# EAGLE design BQ27541 (EAGLE 9.3.0)
CNAME: Fuel Gauge Board; CREVISION: 1A; DESIGNER: µgurkrcl
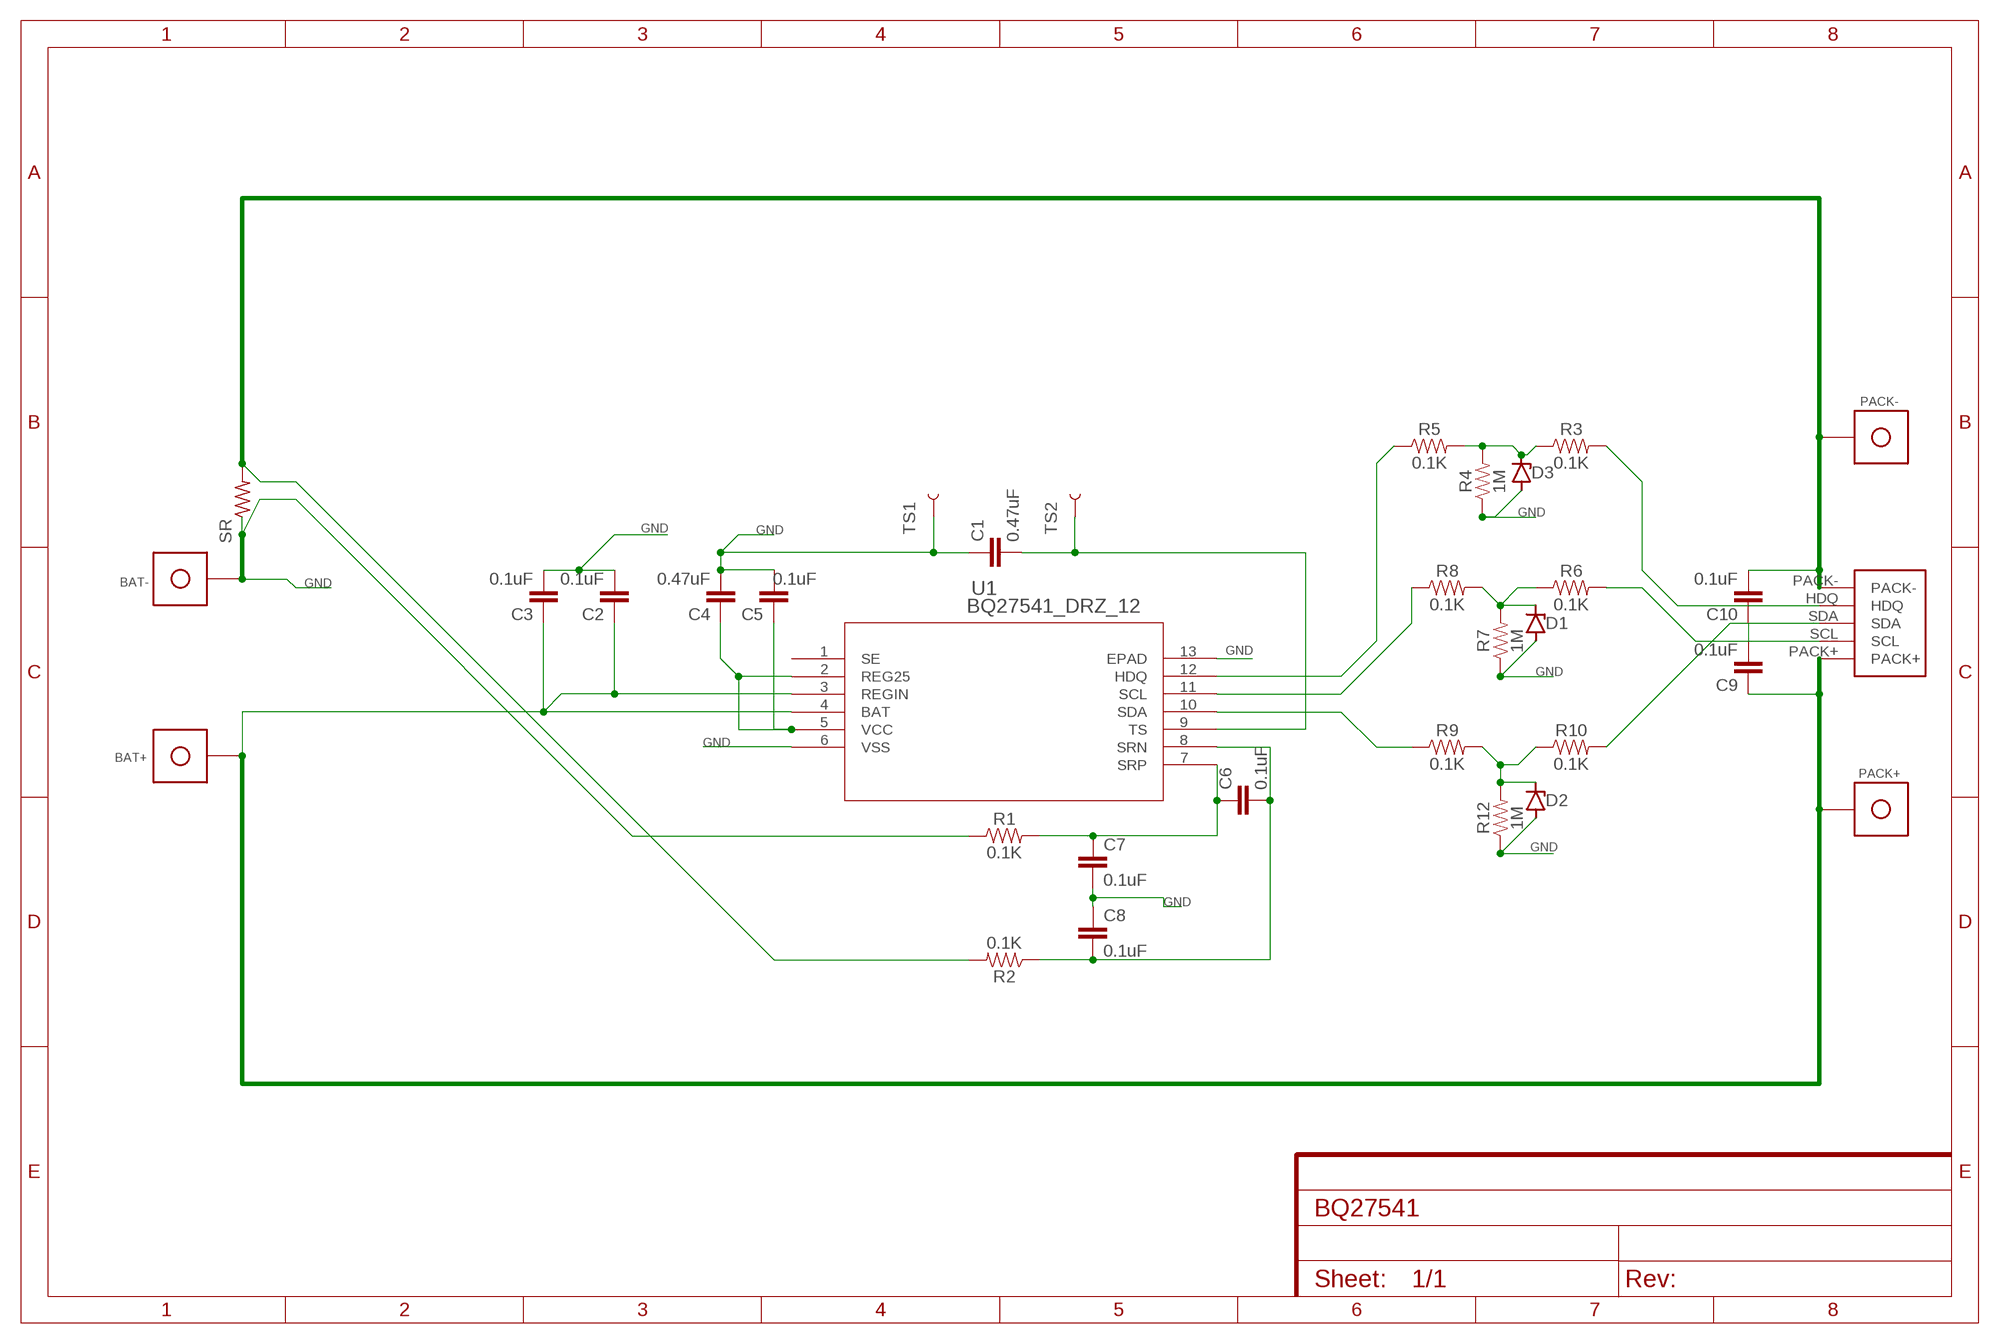
[diagram p0: schematic, sheet 1]

## Parts
BAT+  BAT_TAB  [BATT_TAB]
BAT-  BAT_TAB  [BATT_TAB]
C1  0.47uF  0.1UF-0402-16V-10%  [0402]
C2  0.1uF  0.1UF-0402-16V-10%  [0402]
C3  0.1uF  0.1UF-0402-16V-10%  [0402]
C4  0.47uF  0.1UF-0402-16V-10%  [0402]
C5  0.1uF  0.1UF-0402-16V-10%  [0402]
C6  0.1uF  0.1UF-0402-16V-10%  [0402]
C7  0.1uF  0.1UF-0402-16V-10%  [0402]
C8  0.1uF  0.1UF-0402-16V-10%  [0402]
C9  0.1uF  0.1UF-0402-16V-10%  [0402]
C10  0.1uF  0.1UF-0402-16V-10%  [0402]
D1  ZENER-DIODESOD80C  [SOD80C]
D2  ZENER-DIODESOD80C  [SOD80C]
D3  ZENER-DIODESOD80C  [SOD80C]
PACK+  BAT_TAB  [BATT_TAB]
PACK-  BAT_TAB  [BATT_TAB]
R1  0.1K  22OHM-0402-1/10W-1%  [0402]
R2  0.1K  22OHM-0402-1/10W-1%  [0402]
R3  0.1K  22OHM-0402-1/10W-1%  [0402]
R4  1M  22OHM-0402-1/10W-1%  [0402]
R5  0.1K  22OHM-0402-1/10W-1%  [0402]
R6  0.1K  22OHM-0402-1/10W-1%  [0402]
R7  1M  22OHM-0402-1/10W-1%  [0402]
R8  0.1K  22OHM-0402-1/10W-1%  [0402]
R9  0.1K  22OHM-0402-1/10W-1%  [0402]
R10  0.1K  22OHM-0402-1/10W-1%  [0402]
R12  1M  22OHM-0402-1/10W-1%  [0402]
SR  R-US_R2512  [R2512]
TS1  TEST-POINT3X5  [PAD.03X.05]
TS2  TEST-POINT3X5  [PAD.03X.05]
U1  BQ27541_DRZ_12  [DRZ12_1P95X2P45]
U$1  BAT_COMM_PWR  [BATT_COMM_PWR]

## Nets
GND: BAT-.P$1 C1.1 C2.2 C3.2 C4.2 C5.2 C7.2 C8.1 D1.A D2.A D3.A R1.1 R4.1 R7.1 R12.1 SR.1 TS1.P$1 U1.6(VSS) U1.13(EPAD)
N$1: BAT+.P$1 C2.1 C3.1 C9.1 PACK+.P$1 U1.3(REGIN) U1.4(BAT) U$1.PACK+
N$2: C10.2 PACK-.P$1 R2.2 SR.2 U$1.PACK-
N$3: C4.1 C5.1 U1.2(REG25) U1.5(VCC)
N$4: C6.2 C8.2 R2.1 U1.8(SRN)
N$5: C1.2 TS2.P$1 U1.9(TS)
N$6: C6.1 C7.1 R1.2 U1.7(SRP)
N$8: C9.2 C10.1
N$9: R3.2 U$1.HDQ
N$10: D3.C R3.1 R4.2 R5.2
N$12: R5.1 U1.12(HDQ)
N$13: R8.1 U1.11(SCL)
N$14: D1.C R6.1 R7.2 R8.2
N$15: R6.2 U$1.SCL
N$16: R9.1 U1.10(SDA)
N$17: D2.C R9.2 R10.1 R12.2
N$18: R10.2 U$1.SDA
Unconnected: U1.1(SE)

## Library data of the parts
BAT+ BAT- PACK+ PACK- = ugurkrcl:BAT_TAB
C1 C4 = SparkFun-Capacitors:0.1UF: 0.1µF ceramic capacitors A capacitor is a passive two-terminal electrical component used to store electrical energy temporarily in an electric field.; PROD_ID: CAP-12416; VALUE: 0.1uF
C2 C3 C5-C10 = SparkFun-Capacitors:0.1UF: 0.1µF ceramic capacitors A capacitor is a passive two-terminal electrical component used to store electrical energy temporarily in an electric field.; PROD_ID: CAP-12416
D1-D3 = diode:ZENER-DIODE: Z-Diode
R1-R10 R12 = SparkFun-Resistors:22OHM: 22Ω resistor A resistor is a passive two-terminal electrical component that implements electrical resistance as a circuit element. Resistors act to reduce current flow, and, at the same time, act to lower voltage levels within circuits. - Wikipedia; PROD_ID: RES-12427; VALUE: 22
SR = resistor:R-US_: RESISTOR, American symbol
TS1 TS2 = SparkFun-Connectors:TEST-POINT: SparkFun Test Points Bare copper test points for troubleshooting or In-Circuit-Testing. These are used by our Production team for verifying production board runs using pogo-pins on test beds. SparkFun Products: SparkFun LSM9DS1 Breakout <https://www.sparkfun.com/products/13284> SparkFun PSOC <https://www.sparkfun.com/products/13714> SparkFun Load Cell Amplifier <https://www.sparkfun.com/products/13879>
U1 = Fuel Gauge:BQ27541_DRZ_12; DATASHEETURL: Unknown; FAMILY_NAME: Unknown; GENERIC_PART_NUMBER: BQ27541; INDUSTRY_STD_PKG_TYPE: Unknown; MANUFACTURER: Texas Instruments; PACKAGE_DESIGNATOR: DRZ; PIN_COUNT: 12
U$1 = ugurkrcl:BAT_COMM_PWR

## Board
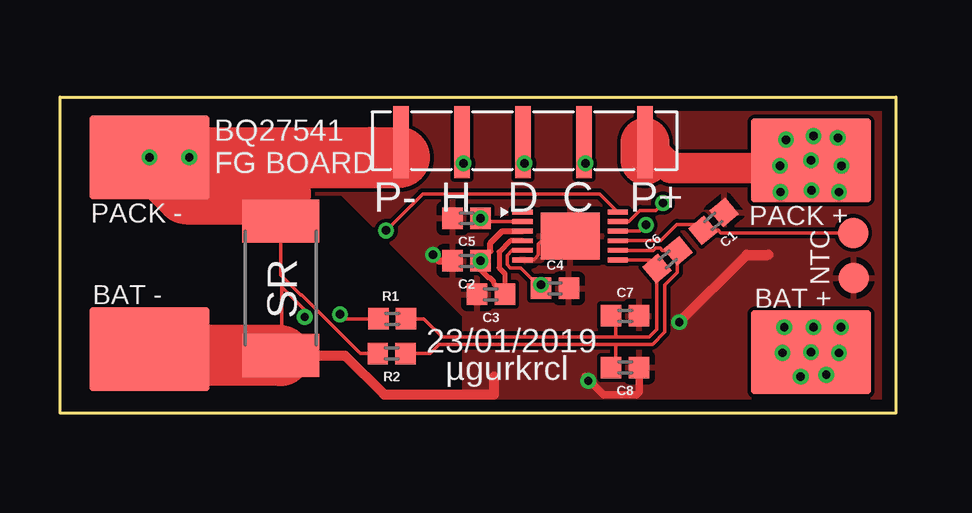
[diagram p1: board, top side]
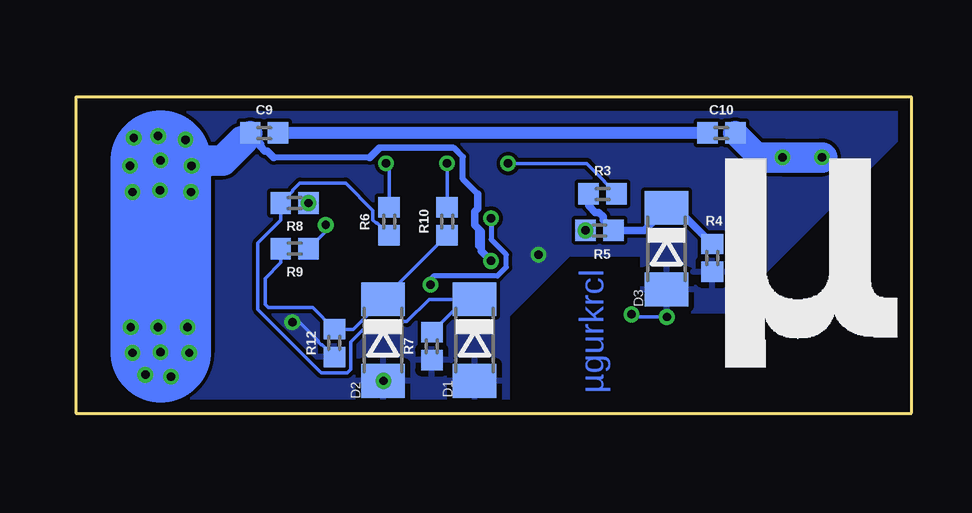
[diagram p2: board, bottom side, seen from below]

Size 34.82 x 13.18 mm. Coordinates in mm from the lower left corner, seen from the top.
Outline: 0,13.18 34.82,13.18 34.82,0 0,0 0,13.18
Copper layers (1*16): Top 0.035mm / dielectric 1.6mm / Bottom 0.035mm
Design rules "Elecrow_2-layer_PCB_eagle_rule": minimum track width 6mil, minimum drill 12mil, track to track 6mil, track to pad 8mil, pad to pad 12mil, via to via 12mil, smd to smd 0mil, copper to edge 20mil, drill to drill 10mil, minimum pad ring 6mil, minimum via ring 6mil, stop-mask expansion 0mil, vias tented up to drill 100mil, thermal gap 10mil

### Footprints (pad centres in the part's own frame; a part is rotated, then mirrored left to right if it is on the bottom)
BATT_TAB = smd 5 x 3.5: P$1 0,0
0402 = smd 0.85 x 0.9: 1 -0.58,0; 2 0.58,0
SOD80C = smd 1.4 x 1.8: A 1.7,0; C -1.7,0
R2512 = smd 1.8 x 3.2: 1 -2.8,0; 2 2.8,0
PAD.03X.05 = smd 1.27 x 1.27: P$1 0,0
DRZ12_1P95X2P45 = smd 0.85 x 0.2: 1 -0.838,1.152; 2 -0.838,0.752; 3 -0.838,0.352; 4 -0.838,-0.048; 5 -0.838,-0.448; 6 -0.838,-0.848; 7 3.124,-0.848; 8 3.124,-0.448; 9 3.124,-0.048; 10 3.124,0.352; 11 3.124,0.752; 12 3.124,1.152 | smd 2.45 x 1.95: 13 1.143,0.152
BATT_COMM_PWR = smd 0.65 x 3: HDQ -2.6,0; PACK+ 5.02,0; PACK- -5.14,0; SCL 2.48,0; SDA -0.06,0

### Placement (x,y rotation side)
BAT+  31.29,2.54 0 top
BAT-  3.73,2.67 0 top
C1  27.23,8 220 top
C2  16.94,6.35 180 top
C3  17.96,4.95 180 top
C4  20.62,5.21 0 top
C5  16.94,8.13 180 top
C6  25.32,6.4 40 top
C7  23.55,4.06 0 top
C8  23.55,1.91 180 top
C9  26.97,11.68 0 bottom
C10  7.92,11.68 0 bottom
D1  18.21,3.05 270 bottom
D2  22.02,3.05 270 bottom
D3  10.21,6.86 270 bottom
PACK+  31.29,10.54 0 top
PACK-  3.73,10.67 0 top
R1  13.84,3.94 0 top
R2  13.82,2.49 180 top
R3  12.88,9.14 0 bottom
R4  8.31,6.48 90 bottom
R5  13,7.62 0 bottom
R6  21.77,8 90 bottom
R7  19.99,2.79 90 bottom
R8  25.7,8.76 180 bottom
R9  25.7,6.86 180 bottom
R10  19.35,8 90 bottom
R12  24.05,2.92 90 bottom
SR  9.19,5.21 90 top
TS1  33.07,5.64 0 top
TS2  33.05,7.52 0 top
U1  20.12,7.24 0 top
U$1  19.35,11.3 0 top

### Tracks (layer width: path | path; a pad name or v marks a point on that pad's centre or on a via)
GND  (via drill 0.35)
  Top 0.152: R1.1 13.09,3.77 | 3.86,2.79 8.81,2.79 SR.1 9.25,2.46 9.25,5.26 | 2.84,2.79 3.86,2.79 | BAT-.P$1 3.86,2.79 | R1.1 13.11,4.09 | U1.13 20.28,7.39 19.93,7.05 19.93,6.6 19.75,6.42 19.3,6.42 U1.6 | 10.02,4.19 v10.2,4.01 10.2,4.3 9.25,5.26 | v11.67,4.12 11.86,3.94 R1.1 | 9.25,5.26
  Top 0.203: U1.13 20.46,6.59 | SR.1 9.45,2.67
  Top 0.305: C8.1 24.13,0.89 24,0.76 22.66,0.76 22.01,1.41 | v22.01,1.35 22.01,1.41 | 22.01,1.41 21.89,1.52 | C2.2 15.8,6.35 v15.54,6.6
  Top 0.406: SR.1 11.87,2.41 13.5,0.78 18.08,0.78 18.08,1.52 | v25.8,3.8 28.61,6.6 29.51,6.6
  Top 2.54: SR.1 3.23,2.41 2.84,2.79
  Bottom 0.152: v25.8,3.8 25.51,3.8 24.73,3.02 24.73,2.98 24.6,2.85 24.56,2.85 R12.1 | v10.2,4.01 11.56,4.01 v11.67,4.12
  Bottom 0.305: D2.A v22.01,1.35
  pour Top: 0.3,12.95 0.3,9.14 11.73,9.14 16.81,4.06 16.81,0.25 34.59,0.25 34.59,12.95
  pour Bottom: 0.3,12.95 34.59,12.95 34.59,0.25 16.81,0.25 16.81,4.06 14.27,6.6 11.25,6.6 11.25,4.22 7.77,4.22 0.3,11.68
N$1  (via drill 0.35)
  Top 0.152: C3.1 18.54,5.85 18.32,6.07
  Top 0.203: U1.4 18.77,7.2 18.29,6.72 18.29,6.06 18.54,5.82 C3.1 18.06,5.43 18.06,5.51 17.91,5.66 17.83,5.66 17.52,5.97 C2.1
  Top 0.254: C2.1 17.93,6.76 17.93,7.09 18.43,7.59 U1.3 | 31.96,10.41 31.42,10.41 PACK+.P$1 30.98,10.22 29.91,10.22 | 24.37,10.54 29.39,10.54 29.39,10.06 29.42,10.04 29.42,9.14 | 29.45,10.22 29.91,10.22 | 29.91,10.22 v30,10.31 | BAT+.P$1 32.44,2.54 v32.46,2.52
  Top 0.406: 30.78,9.73 30.78,10.41 30.91,10.54 PACK+.P$1 30.68,10.54
  Top 1.27: U$1.PACK+ 25.45,10.22 29.45,10.22
  Top 2.032: U$1.PACK+ 24.37,10.54
  Bottom 0.152: 18.93,10.84 19.1,11.02 22.15,11.02 22.5,10.67 26.57,10.67 | 18.08,8.42 18.13,8.38 18.13,6.96 17.93,6.76
  Bottom 0.254: 18.08,9.14 18.7,9.76 18.7,10.69 19.08,11.07 22.17,11.07 22.18,11.06 | 22.57,10.67 26.57,10.67 26.81,10.9 26.96,10.9 27.15,11.1 27.15,11.24 27.25,11.34 | C9.1 28.53,10.7 28.7,10.54 28.97,10.27 | 28.95,10.28 29.42,9.82 29.42,8.97 29.77,8.61 30.27,8.61 30.63,8.97 30.63,9.78 | 30.78,10.54 30.63,10.39 30.63,9.78 | 30.63,9.78 30.92,10.07 | 30.92,10.07 31.39,10.54 | 31.72,10.87 31.39,10.54 | 31.39,10.54 PACK+.P$1 31.29,10.39 v32.46,9.22 32.56,9.32 v32.56,10.31 32.56,10.39 v31.39,11.56 | v32.54,3.58 32.54,2.59 v32.46,2.52 32.46,2.13 v31.93,1.6 30.94,1.6 v30.86,1.52 31.39,2.06 v31.39,3.58 | BAT+.P$1 30.12,2.54 v30.1,2.52 30.1,3.51 v30.17,3.58 | v30.25,11.41 30.4,11.56 v31.39,11.56 | v31.39,11.56 31.47,11.48 v32.41,11.48 31.47,10.54 31.39,10.54 | v31.32,9.3 30.1,9.3 v30.02,9.22 30.87,10.07 30.92,10.07
  Bottom 0.305: 22.18,11.06 22.57,10.67 | 27.9,11.34 27.25,11.34 27.12,11.22 27.12,11.11 | 26.57,10.67 26.84,10.93 26.95,10.93 27.12,11.11 | 27.12,11.11 27.55,11.54 C9.1 | 18.08,9.14 18.08,8.53 18.2,8.41 18.2,7.84 17.93,7.57 17.93,6.76 C2.1
  Bottom 0.406: 29.31,10.28 28.95,10.28
  Bottom 1.016: C9.1 27.9,11.34 | PACK+.P$1 31.04,10.28 30.98,10.28 30.98,10.54 PACK+.P$1
  Bottom 1.27: 27.9,11.34 28.53,10.7 | 30.78,10.54 28.7,10.54
  Bottom 4.191: PACK+.P$1 BAT+.P$1
  other vias: 31.29,2.54 31.29,10.54 17.52,6.35
N$2  (via drill 0.35)
  Top 0.152: SR.2 9.19,7.87 9.19,5.77 10.04,4.93 10.08,4.93 12.52,2.49 R2.2 | U$1.PACK- 13.58,10.67 13,10.67
  Top 0.254: 9.19,9.14 9.19,7.87
  Top 2.54: 9.19,9.14 5.26,9.14 PACK-.P$1 v5.38,10.67 13,10.67 14.15,10.67
  Bottom 1.016: 6.33,10.67 C10.2
  Bottom 1.27: 6.33,10.67 v5.38,10.67 PACK-.P$1
  other vias: 3.73,10.67
N$3  (via drill 0.35)
  Top 0.152: U1.2 17.66,7.99 C5.1 | U1.5 18.84,6.8 18.63,6.59 18.63,6.2 18.76,6.06 19.19,6.06 C4.1
  Top 0.203: v20.04,5.36 C4.1
  Bottom 0.203: v20.04,5.36 20.04,5.61 19.93,5.72 17.26,5.72 16.89,6.09 16.89,6.61 17.52,7.24 C5.1
  other vias: 17.52,8.13
N$4
  Top 0.152: R2.1 15.42,2.49 15.8,2.87 23.16,2.87 | 23.16,2.87 24.69,2.87 25.2,3.38 25.2,5.34 25.72,5.86 25.72,6.74 C6.2 arc90 25.75,6.79 25.1,6.79 25.01,6.89 24.81,6.89 24.72,6.79 U1.8 | C8.2 23.16,2.1 23.16,2.87
N$5
  Top 0.152: U1.9 25.02,7.19 25.7,7.87 26.54,7.87 C1.2 27.43,7.63 27.54,7.52 TS2.P$1
N$6
  Top 0.152: R1.2 15.16,3.94 15.92,3.17 23.16,3.17 | U1.7 24.51,6.39 arc-90 C6.1 24.87,3.48 24.56,3.17 23.16,3.17 | C7.1 23.16,3.87 23.16,3.17
N$8
  Bottom 0.508: C10.1 C9.2
N$9  (via drill 0.35)
  Top 0.152: U$1.HDQ v16.81,10.41
  Bottom 0.152: R3.2 12.8,9.65 12.8,9.69 13.53,10.41 v16.81,10.41
N$10
  Bottom 0.152: D3.C 10.61,8.56
  Bottom 0.305: R3.1 13.46,8.65 13.18,8.38 13.03,8.38 12.85,8.2 12.85,8.05 R5.2 11.15,7.62 D3.C 9.81,8.56 R4.2
N$12  (via drill 0.35)
  Top 0.152: U1.12 22.49,9.14 15.11,9.14 R5.1
  other vias: 13.58,7.62
N$13  (via drill 0.35)
  Top 0.152: U1.11 23.69,7.99 24.16,8.46 24.82,8.46 R8.1
  other vias: 25.12,8.76
N$14
  Bottom 0.152: R6.1 22.27,7.93 22.31,7.93 22.45,8.06 22.45,8.46 23.59,9.6 25.48,9.6 25.78,9.31 25.78,9.27 R8.2 26.28,8.06 27.24,7.1 27.24,4.33 24.6,1.69 23.51,1.69 23.37,1.82 23.37,2.96 22.52,3.82 21.03,3.82 20.1,4.75 D1.C 18.62,4.75 R7.2
N$15  (via drill 0.35)
  Top 0.305: U$1.SCL 21.83,10.47 v21.89,10.41
  Bottom 0.152: R6.2 21.77,10.29 v21.89,10.41
N$16  (via drill 0.35)
  Top 0.152: U1.10 24.15,7.59 v24.41,7.85
  Bottom 0.152: v24.41,7.85 24.41,7.57 R9.1
N$17
  Bottom 0.152: 19.41,7.42 R10.1 D2.C 23.27,3.5 R12.2 24.95,4.4 26.8,4.4 26.94,4.54 26.94,5.62 26.28,6.28 R9.2
N$18  (via drill 0.35)
  Top 0.203: U$1.SDA 19.35,11.24 v19.35,10.41
  Bottom 0.152: R10.2 v19.35,10.41

### Text on the board
Bottom: µgurkrcl
tNames: BQ27541 / FG BOARD | PACK - | PACK + | NTC | BAT - | BAT + | 23/01/2019 | µgurkrcl